# Altium schematic sheet TYPE-C-31-M-12_2025-02-03.schdoc
size 54 x 65 mm
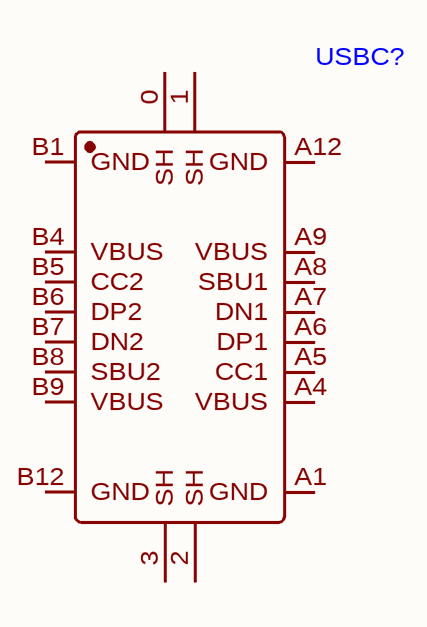
[diagram p0: TYPE-C-31-M-12_2025-02-03.schdoc]

## Parts
USBC?  (no value)  [USB-C_SMD-TYPE-C-31-M-12]

## Nets

Not connected (* = marked no-connect by the designer): USBC? 0(SH) 1(SH) 2(SH) 3(SH) A1(GND) A4(VBUS) A5(CC1) A6(DP1) A7(DN1) A8(SBU1) A9(VBUS) A12(GND) B1(GND) B4(VBUS) B5(CC2) B6(DP2) B7(DN2) B8(SBU2) B9(VBUS) B12(GND)

## Library data of the parts
USBC? = TYPE-C-31-M-12